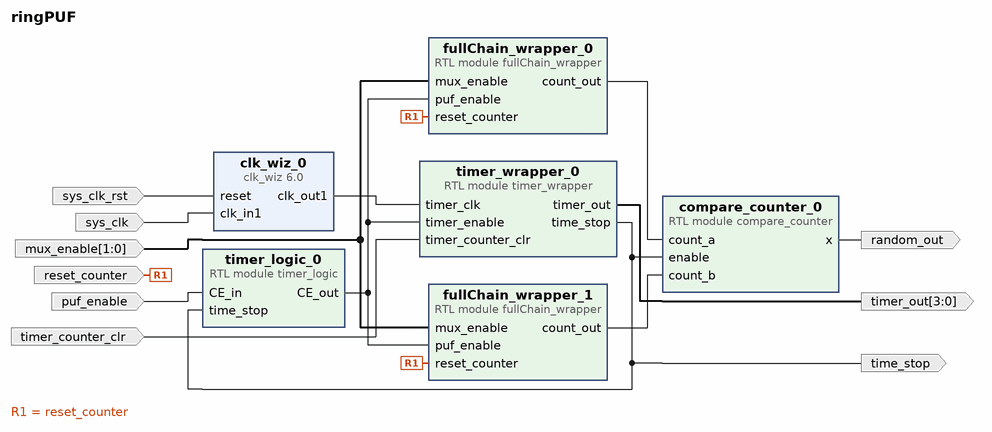
[diagram p0: block diagram of the top level]
# Vivado block design ringPUF, xc7z020clg484-1, Vivado 2024.2
create_bd_design ringPUF

create_bd_port -dir O random_out
create_bd_port -dir I -type clk sys_clk
set_property -dict {CONFIG.FREQ_HZ 100000000 CONFIG.PHASE 0.0} [get_bd_ports sys_clk]
create_bd_port -dir I -from 1 -to 0 mux_enable
create_bd_port -dir I puf_enable
create_bd_port -dir I timer_counter_clr
create_bd_port -dir O -from 3 -to 0 timer_out
create_bd_port -dir I -type rst sys_clk_rst
set_property -dict {CONFIG.POLARITY ACTIVE_HIGH} [get_bd_ports sys_clk_rst]
create_bd_port -dir O time_stop
create_bd_port -dir I -type data reset_counter

create_bd_cell -type module -reference fullChain_wrapper fullChain_wrapper_0
create_bd_cell -type module -reference fullChain_wrapper fullChain_wrapper_1
create_bd_cell -type module -reference compare_counter compare_counter_0
create_bd_cell -type module -reference timer_wrapper timer_wrapper_0
create_bd_cell -type ip -vlnv xilinx.com:ip:clk_wiz:6.0 clk_wiz_0
set_property -dict [list \
  CONFIG.CLK_IN1_BOARD_INTERFACE sys_clock \
  CONFIG.USE_BOARD_FLOW true \
  CONFIG.USE_LOCKED false \
  CONFIG.USE_POWER_DOWN false \
] [get_bd_cells clk_wiz_0]
create_bd_cell -type module -reference timer_logic timer_logic_0

# ---- connections ----

connect_bd_net [get_bd_ports reset_counter] [get_bd_pins fullChain_wrapper_0/reset_counter] [get_bd_pins fullChain_wrapper_1/reset_counter]
connect_bd_net [get_bd_pins timer_logic_0/CE_out] \
  [get_bd_pins fullChain_wrapper_1/puf_enable] [get_bd_pins fullChain_wrapper_0/puf_enable] \
  [get_bd_pins timer_wrapper_0/timer_enable]
connect_bd_net [get_bd_pins clk_wiz_0/clk_out1] [get_bd_pins timer_wrapper_0/timer_clk]
connect_bd_net [get_bd_pins compare_counter_0/x] [get_bd_ports random_out]
connect_bd_net [get_bd_pins fullChain_wrapper_0/count_out] [get_bd_pins compare_counter_0/count_a]
connect_bd_net [get_bd_pins fullChain_wrapper_1/count_out] [get_bd_pins compare_counter_0/count_b]
connect_bd_net [get_bd_ports mux_enable] [get_bd_pins fullChain_wrapper_0/mux_enable] [get_bd_pins fullChain_wrapper_1/mux_enable]
connect_bd_net [get_bd_ports puf_enable] [get_bd_pins timer_logic_0/CE_in]
connect_bd_net [get_bd_ports sys_clk_rst] [get_bd_pins clk_wiz_0/reset]
connect_bd_net -net sys_clock_1 [get_bd_ports sys_clk] [get_bd_pins clk_wiz_0/clk_in1]
connect_bd_net [get_bd_ports timer_counter_clr] [get_bd_pins timer_wrapper_0/timer_counter_clr]
connect_bd_net [get_bd_pins timer_wrapper_0/time_stop] \
  [get_bd_pins compare_counter_0/enable] [get_bd_pins timer_logic_0/time_stop] [get_bd_ports time_stop]
connect_bd_net [get_bd_pins timer_wrapper_0/timer_out] [get_bd_ports timer_out]

validate_bd_design
save_bd_design
